# Altium schematic sheet FPGA-Misc.SchDoc: ZoM Mod A - FPGA MIsc
size A4; Organization: Trenz Electronic GmbH / TT; DocumentNumber: 11; Revision: 01; SheetNumber: 11; SheetTotal: 13; Date: 12/16/2014
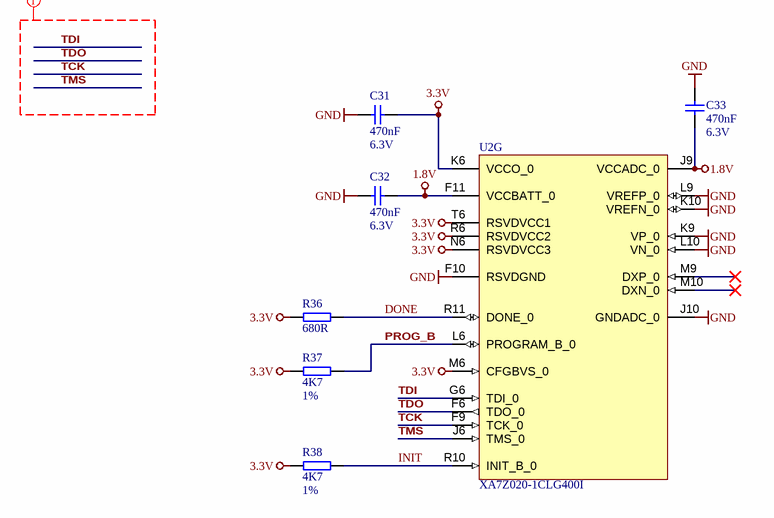
[diagram p0: FPGA-Misc.SchDoc]

## Parts
C31  470nF  Voltage: 6.3V  [CAPC0603X33N]
C32  470nF  Voltage: 6.3V  [CAPC0603X33N]
C33  470nF  Voltage: 6.3V  [CAPC0603X33N]
R36  680R  [RESC1005X40N]
R37  4K7  Tolerance: 1%  [RESC0603X26N]
R38  4K7  Tolerance: 1%  [RESC0603X26N]
U2  XA7Z020-1CLG400I  [BGA400C80P20X20_1700X1700X160N]  (part G of 8)

## Nets
1.8V: C32.2 C33.2 U2.F11(VCCBATT_0) U2.J9(VCCADC_0)
3.3V: C31.2 R36.1 R37.2 R38.2 U2.K6(VCCO_0) U2.M6(CFGBVS_0) U2.N6(RSVDVCC3) U2.R6(RSVDVCC2) U2.T6(RSVDVCC1)
GND: C31.1 C32.1 C33.1 U2.F10(RSVDGND) U2.J10(GNDADC_0) U2.K9(VP_0) U2.K10(VREFN_0) U2.L9(VREFP_0) U2.L10(VN_0)
DONE: R36.2 U2.R11(DONE_0)
INIT: R38.1 U2.R10(INIT_B_0)
PROG_B: R37.1 U2.L6(PROGRAM_B_0)
TCK: U2.F9(TCK_0)
TDI: U2.G6(TDI_0)
TDO: U2.F6(TDO_0)
TMS: U2.J6(TMS_0)

Not connected (* = marked no-connect by the designer): U2 M9(DXP_0)* M10(DXN_0)*

## Layout directives
net class JTAG: TCK, TDI, TDO, TMS

## Notes on the sheet
- Title:
- Nummer:
- Rev.
- Datum:
- A4
- Zeichner:
- Blatt
- von
- Filename:

## Library data of the parts
C31-C33 = 24921: KON 470nF X5R 6.3V SMD; AN: 24921; Value: 470n; Tolerance: 20%; Mixed: SMT; Preferred: Yes; Case: 0603 (0201); Technology: X5R
R36 = 22761: WID SMD 680R 1% 0,063W; AN: 22761; Value: 680; Mixed: SMT; Preferred: Yes; Case: 1005 (0402)
R37 R38 = 25242: WID SMD 4K7 1% 0,05W; AN: 25242; Value: 4.7K; Mixed: SMT; Preferred: Yes; Case: 0603 (0201); HelpURL: B:\AD\adlib\datasheet\R0201
U2 = 25981: AN: 25981; Mixed: SMT; Trenz-Stock: Yes; Case: CLG400; HelpURL: B:\AD\adlib\datasheet\XC7